# EAGLE design CMUFull (EAGLE 8.6.0)
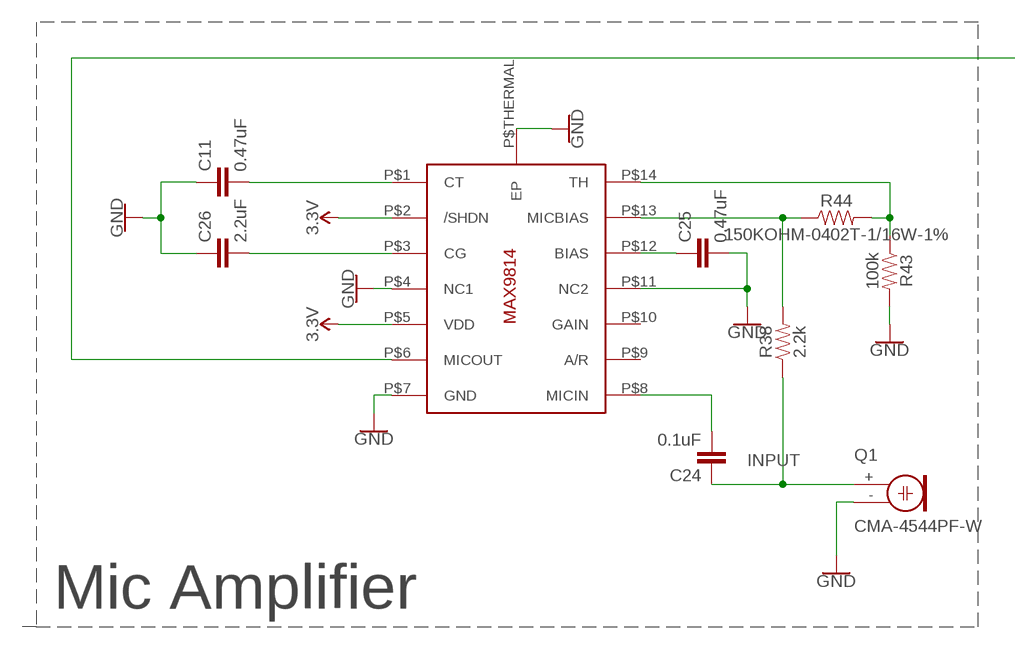
[diagram p0: schematic, sheet 1, part 1 of 2]
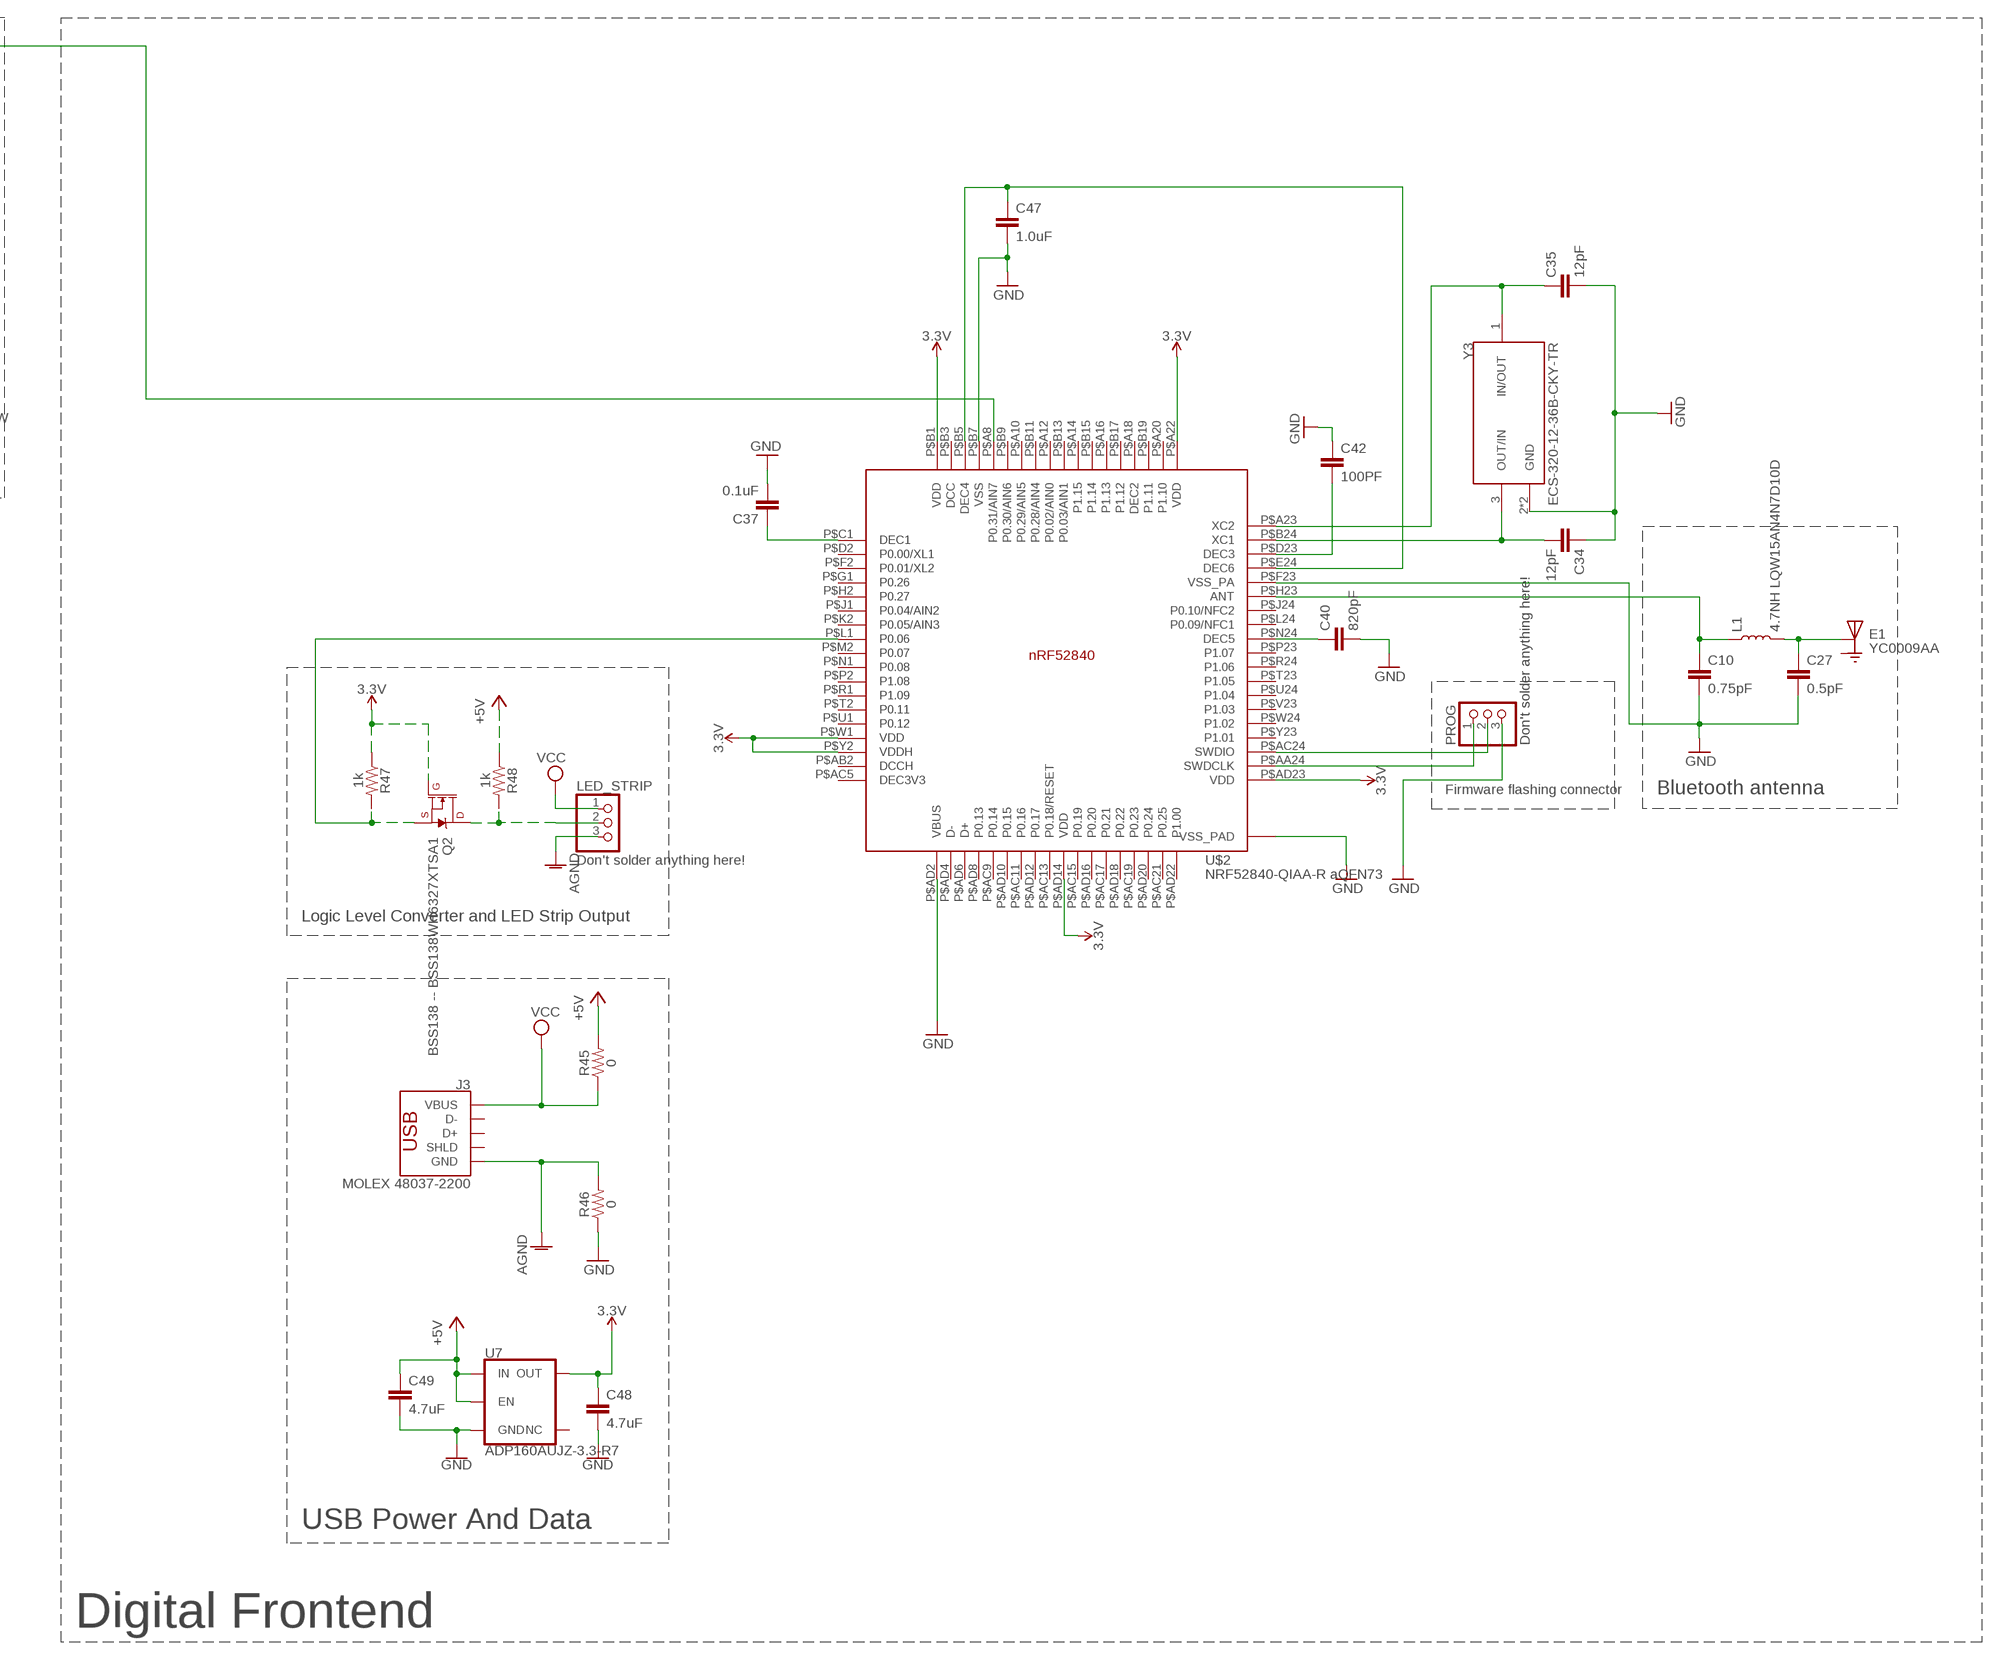
[diagram p1: schematic, sheet 1, part 2 of 2]

## Parts
C10  0.75pF  CAP-0402-TIGHT  [0402-TIGHT]
C11  0.47uF  CAP-0402-TIGHT  [0402-TIGHT]
C24  0.1uF  0.1UF-0402-6.3V-10%-X7R  [0402]
C25  0.47uF  CAP-0402-TIGHT  [0402-TIGHT]
C26  2.2uF  2.2UF-0402_TIGHT-10V-10%-X5R  [0402-TIGHT]
C27  0.5pF  0.5PF-0402_TIGHT-50V-PM0.05PF-NP0  [0402-TIGHT]
C34  12pF  12PF-0402T-50V-5%  [0402-TIGHT]
C35  12pF  12PF-0402T-50V-5%  [0402-TIGHT]
C37  0.1uF  0.1UF-0402-16V-10%  [0402]
C40  820pF  CAP-0402  [0402]
C42  100PF  100PF-0402-50V-5%  [0402]
C47  1.0uF  1.0UF-0402-16V-10%  [0402]
C48  4.7uF  4.7UF-0402_TIGHT-6.3V-20%-X5R  [0402-TIGHT]
C49  4.7uF  4.7UF-0402_TIGHT-6.3V-20%-X5R  [0402-TIGHT]
E1  YC0009AA  [XCVR_YC0009AA]
J3  MOLEX 48037-2200  USB_A_SMT_MALE  [USB-A-SMT-MALE]
L1  4.7NH LQW15AN4N7D10D  INDUCTOR-0402-3.9NH  [0402]
LED_STRIP  Don't solder anything here!  PINHD-1X3  [1X03]
PROG  Don't solder anything here!  PINHD-1X3  [1X03]
Q1  CMA-4544PF-W  ELECTRET  [9.7ELECTRET]
Q2  BSS138 -- BSS138WH6327XTSA1  MOSFET-NCH-BSS138  [SOT23-3]
R38  2.2k  2.2KOHM-0402T-1/16W-1%  [0402-TIGHT]
R43  100k  100KOHM-0402T-1/16W-1%  [0402-TIGHT]
R44  150KOHM-0402T-1/16W-1%  [0402-TIGHT]
R45  0  0OHM-0402-1/10W  [0402]
R46  0  0OHM-0402-1/10W  [0402]
R47  1k  1KOHM-0402T-1/16W-1%  [0402-TIGHT]
R48  1k  1KOHM-0402T-1/16W-1%  [0402-TIGHT]
U7  ADP160AUJZ-3.3-R7  ADP160  [SOT23-5]
U$1  MAX9814ETD+T  MAX9814TDFN14  [TDFN14_3X3MM]
U$2  NRF52840-QIAA-R aQFN73  NRF52840_QF  [AQFN50P700X700X85_HS-74N]
Y3  ECS-320-12-36B-CKY-TR  [XTAL_ECS-163.84-10-36-JGN-TR]

## Nets
3.3V: C48.1 Q2.1(G) R47.1 U7.5(OUT) U$1.P$2(/SHDN) U$1.P$5(VDD) U$2.P$A22(VDD) U$2.P$AD14(VDD) U$2.P$AD23(VDD) U$2.P$B1(VDD) U$2.P$W1(VDD) U$2.P$Y2(VDDH)
+5V: C49.1 R45.2 R48.1 U7.1(IN) U7.3(EN)
AGND [5VSupply]: J3.GND1(GND) LED_STRIP.3 R46.2
GND: C10.2 C11.1 C25.2 C26.1 C27.2 C34.1 C35.2 C37.2 C40.2 C42.1 C47.2 C48.2 C49.2 PROG.3 Q1.- R43.2 R46.1 U7.2(GND) U$1.P$4(NC1) U$1.P$7(GND) U$1.P$11(NC2) U$1.P$THERMAL(EP) U$2.P$74(VSS_PAD) U$2.P$AD2(VBUS) U$2.P$B7(VSS) U$2.P$F23(VSS_PA) Y3.2(GND) Y3.4(GND)
INPUT: C24.1 Q1.+ R38.1
N$3: U$1.P$6(MICOUT) U$2.P$A8(P0.31/AIN7)
N$35: C25.1 U$1.P$12(BIAS)
N$41: C24.2 U$1.P$8(MICIN)
N$42: C11.2 U$1.P$1(CT)
N$43: C26.2 U$1.P$3(CG)
N$44: R43.1 R44.2 U$1.P$14(TH)
N$45: R38.2 R44.1 U$1.P$13(MICBIAS)
N$48: C35.1 U$2.P$A23(XC2) Y3.1(IN/OUT)
N$49: C34.2 U$2.P$B24(XC1) Y3.3(OUT/IN)
N$51: C37.1 U$2.P$C1(DEC1)
N$54: PROG.1 U$2.P$AA24(SWDCLK)
N$56: PROG.2 U$2.P$AC24(SWDIO)
N$59: LED_STRIP.2 Q2.3(D) R48.2
N$60: C47.1 U$2.P$B5(DEC4) U$2.P$E24(DEC6)
N$62: C40.1 U$2.P$N24(DEC5)
N$63: C42.2 U$2.P$D23(DEC3)
N$64: C10.1 L1.1 U$2.P$H23(ANT)
N$65: C27.1 E1.1(INPUT) L1.2
N$73: Q2.2(S) R47.2 U$2.P$L1(P0.06)
VCC [5VSupply]: J3.VBUS1(VBUS) LED_STRIP.1 R45.1
Unconnected: J3.D+1(D+) J3.D-1(D-) J3.SHLD1(SHLD) J3.SHLD2(SHLD) U7.4(NC) U$1.P$9(A/R) U$1.P$10(GAIN) U$2.P$A10(P0.29/AIN5) U$2.P$A12(P0.02/AIN0) U$2.P$A14(P1.15) U$2.P$A16(P1.13) U$2.P$A18(DEC2) U$2.P$A20(P1.10) U$2.P$AB2(DCCH) U$2.P$AC5(DEC3V3) U$2.P$AC9(P0.14) U$2.P$AC11(P0.16) U$2.P$AC13(P0.18/RESET) U$2.P$AC15(P0.19) U$2.P$AC17(P0.21) U$2.P$AC19(P0.23) U$2.P$AC21(P0.25) U$2.P$AD4(D-) U$2.P$AD6(D+) U$2.P$AD8(P0.13) U$2.P$AD10(P0.15) U$2.P$AD12(P0.17) U$2.P$AD16(P0.20) U$2.P$AD18(P0.22) U$2.P$AD20(P0.24) U$2.P$AD22(P1.00) U$2.P$B3(DCC) U$2.P$B9(P0.30/AIN6) U$2.P$B11(P0.28/AIN4) U$2.P$B13(P0.03/AIN1) U$2.P$B15(P1.14) U$2.P$B17(P1.12) U$2.P$B19(P1.11) U$2.P$D2(P0.00/XL1) U$2.P$F2(P0.01/XL2) U$2.P$G1(P0.26) U$2.P$H2(P0.27) U$2.P$J1(P0.04/AIN2) U$2.P$J24(P0.10/NFC2) U$2.P$K2(P0.05/AIN3) U$2.P$L24(P0.09/NFC1) U$2.P$M2(P0.07) U$2.P$N1(P0.08) U$2.P$P2(P1.08) U$2.P$P23(P1.07) U$2.P$R1(P1.09) U$2.P$R24(P1.06) U$2.P$T2(P0.11) U$2.P$T23(P1.05) U$2.P$U1(P0.12) U$2.P$U24(P1.04) U$2.P$V23(P1.03) U$2.P$W24(P1.02) U$2.P$Y23(P1.01)

## Notes on the sheet
- Mic Amplifier
- Firmware flashing connector | Bluetooth antenna
- Logic Level Converter and LED Strip Output
- USB Power And Data
- Digital Frontend

## Power pins joined to a net without a drawn wire
GND: E1.2(GND) E1.3(GND)

## Library data of the parts
C10 C11 C25 C40 = SparkFun-Capacitors:CAP
C24 = SparkFun-Capacitors:0.1UF: 0.1µF ceramic capacitors A capacitor is a passive two-terminal electrical component used to store electrical energy temporarily in an electric field.; PROD_ID: CAP-14993
C26 = SparkFun-Capacitors:2.2UF: 2.2µF ceramic capacitors A capacitor is a passive two-terminal electrical component used to store electrical energy temporarily in an electric field.; PROD_ID: CAP-14232
C27 = SparkFun-Capacitors:0.5PF: 0.5pF ceramic capacitors A capacitor is a passive two-terminal electrical component used to store electrical energy temporarily in an electric field.; PROD_ID: CAP-14362
C34 C35 = SparkFun-Capacitors:12PF: 12pF ceramic capacitors A capacitor is a passive two-terminal electrical component used to store electrical energy temporarily in an electric field.; PROD_ID: CAP-14665
C37 = SparkFun-Capacitors:0.1UF: 0.1µF ceramic capacitors A capacitor is a passive two-terminal electrical component used to store electrical energy temporarily in an electric field.; PROD_ID: CAP-12416
C42 = SparkFun-Capacitors:100PF: 100pF/0.1nF ceramic capacitors A capacitor is a passive two-terminal electrical component used to store electrical energy temporarily in an electric field.; PROD_ID: CAP-13458
C47 = SparkFun-Capacitors:1.0UF: 1µF ceramic capacitors A capacitor is a passive two-terminal electrical component used to store electrical energy temporarily in an electric field.; PROD_ID: CAP-12417
C48 C49 = SparkFun-Capacitors:4.7UF: 4.7µF ceramic capacitors A capacitor is a passive two-terminal electrical component used to store electrical energy temporarily in an electric field.; PROD_ID: CAP-14240
E1 = YC0009AA:YC0009AA: 2400-2500 MHz Wi-Fi（BT）, 3.2*1.6*0.5mm,ceramic SMD Antenna Check prices <https://pricing.snapeda.com/parts/YC0009AA/Quectel/view-part?ref=eda>; AVAILABILITY: In Stock; DESCRIPTION: 2400-2500 MHz Wi-Fi（BT）, 3.2*1.6*0.5mm,ceramic SMD Antenna; MF: Quectel; MP: YC0009AA; PACKAGE: None; PRICE: None; PURCHASE-URL: https://pricing.snapeda.com/search/part/YC0009AA/?ref=eda
J3 = SparkFun-Connectors:USB_A: USB-A Connector Male and female variants, as well as PTH and SMT variants SparkFun Products: SparkFun XBee Explorer Dongle <https://www.sparkfun.com/products/11697> PTH Male SparkFun MicroView-USB Programmer <https://www.sparkfun.com/products/12924> SMT Male SparkFun USB Type A Female Breakout <https://www.sparkfun.com/products/12700> SMT Female; PROD_ID: CONN-11499
L1 = SparkFun-Coils:INDUCTOR: Inductors Resist changes in electrical current. Basically a coil of wire. SparkFun Products: SparkFun Load Cell Amplifier - HX711 <https://www.sparkfun.com/products/13879> IOIO-OTG - V2.2 <https://www.sparkfun.com/products/13613>; PROD_ID: NDUC-13457; VALUE: 3.9NH
LED_STRIP PROG = pinhead:PINHD-1X3: PIN HEADER
Q1 = adafruit:ELECTRET: Electret microphone Thru hole 2.54mm spacing with 9.7mm diameter
Q2 = SparkFun-DiscreteSemi:MOSFET-NCH: N-channel MOSFETs Voltage controlled devices that allow control of high current outputs. SparkFun Products: SparkFun OpenScale <https://www.sparkfun.com/products/13261> SparkFun Digital Sandbox <https://www.sparkfun.com/products/12651> SparkFun Monster Moto Shield <https://www.sparkfun.com/products/10182> SparkFun MOSFET Power Controller <https://www.sparkfun.com/products/11214>; PROD_ID: TRANS-00830; VALUE: 220mA/50V/3.5Ω
R38 = SparkFun-Resistors:2.2KOHM: 2.2kΩ resistor A resistor is a passive two-terminal electrical component that implements electrical resistance as a circuit element. Resistors act to reduce current flow, and, at the same time, act to lower voltage levels within circuits. - Wikipedia; PROD_ID: RES-14341
R43 = SparkFun-Resistors:100KOHM: 100kΩ resistor A resistor is a passive two-terminal electrical component that implements electrical resistance as a circuit element. Resistors act to reduce current flow, and, at the same time, act to lower voltage levels within circuits. - Wikipedia; PROD_ID: RES-13495
R44 = SparkFun-Resistors:150KOHM: 150kΩ resistor A resistor is a passive two-terminal electrical component that implements electrical resistance as a circuit element. Resistors act to reduce current flow, and, at the same time, act to lower voltage levels within circuits. - Wikipedia; PROD_ID: RES-15093
R45 R46 = SparkFun-Resistors:0OHM: 0Ω resistor A resistor is a passive two-terminal electrical component that implements electrical resistance as a circuit element. Resistors act to reduce current flow, and, at the same time, act to lower voltage levels within circuits. - Wikipedia; PROD_ID: RES-14244
R47 R48 = SparkFun-Resistors:1KOHM: 1kΩ resistor A resistor is a passive two-terminal electrical component that implements electrical resistance as a circuit element. Resistors act to reduce current flow, and, at the same time, act to lower voltage levels within circuits. - Wikipedia; PROD_ID: RES-14342
U7 = SparkFun-IC-Power:ADP160: Nanopower LDO Iq less than 1uA for low Iload; PROD_ID: VREG-11306; VALUE: ADP160
U$1 = adafruit:MAX9814
U$2 = Nordic_nRF:NRF52840_QF: nRF52840 Features Advanced Single chip 2.4 GHz multi-protocol SoC 32-bit ARM Cortex-M4F Processor 1.7v to 5.5v operation 1MB flash + 256kB RAM Bluetooth 5 support for long range and high throughput 802.15.4 radio support On-chip NFC PPI –Programmable Peripheral Interconnect Automated power management system with automatic power management of each peripheral Configurable I/O mapping for analog and digital I/O 48 x GPIO 1 x QSPI 4 x Master/Slave SPI 2 x Two-wire interface (I²C) I²S interface 2 x UART 4 x PWM USB 2.0 controller ARM TrustZone CryptoCell-310 Cryptographic and security module AES 128-bit ECB/CCM/AAR hardware accelerator Digital microphone interface (PDM) Quadrature decoder 12-bit ADC Low power comparator On-chip 50Ω balun On-air compatible with nRF52, nRF51 and nRF24 Series Applications Advanced high performance wearables Wearables for secure payments Virtual Reality/Augmented Reality systems Smart Home sensor networks Smart city sensor networks High performance HID controllers Internet of Things (IoT) sensor networks Smart door locks Smart lighting networks Connected white goods
Y3 = ECS-320-12-36B-CKY-TR:ECS-320-12-36B-CKY-TR: The minature ECX-2236 is a compact SMD Crystal. The industry standard 2.5 x 2.0 x 0.55 mm ceramic package is ideal for today’s SMD manufacturing environment. Check prices <https://pricing.snapeda.com/parts/ECS-320-12-36B-CKY-TR/ECS/view-part?ref=eda>; AVAILABILITY: In Stock; DESCRIPTION: 32MHz ±10ppm Crystal 12pF 40 Ohms 4-SMD, No Lead; MF: ECS; MP: ECS-320-12-36B-CKY-TR; PACKAGE: SMD-4 ECS International; PRICE: None; PURCHASE-URL: https://pricing.snapeda.com/search/part/ECS-320-12-36B-CKY-TR/?ref=eda

## Net classes
0 default: width 0.152 mm, clearance 0.152 mm
1 5VSupply: width 0.914 mm, clearance 0.254 mm

## Board
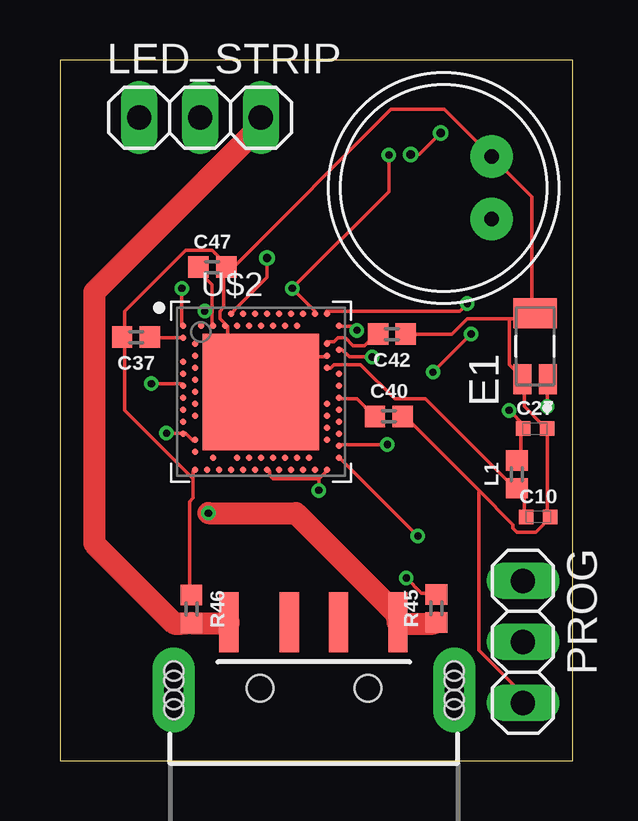
[diagram p2: board, top side]
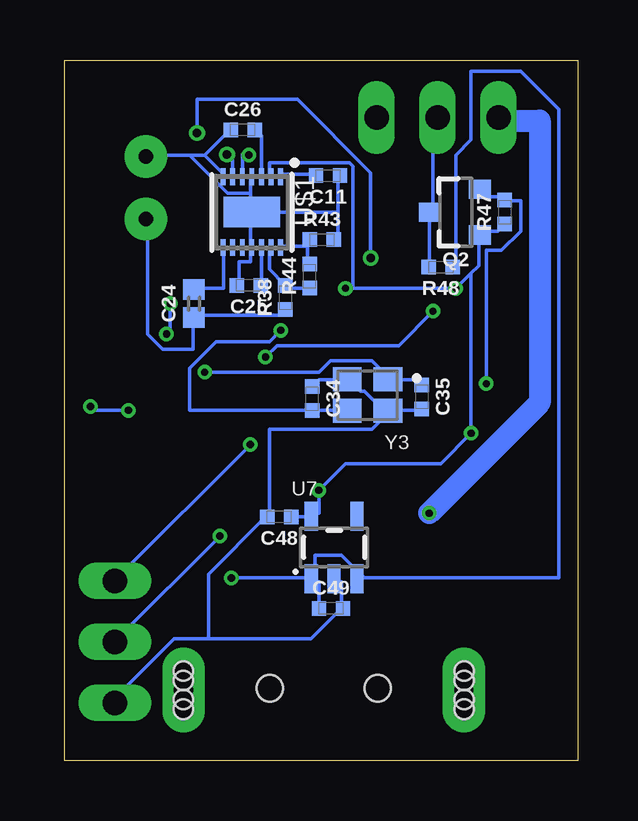
[diagram p3: board, bottom side, seen from below]

Size 21.39 x 29.2 mm. Coordinates in mm from the lower left corner, seen from the top.
Outline: 0,0 21.39,0 21.39,29.2 0,29.2 0,0
Copper layers (1*16): Top 0.035mm / dielectric 1mm / Bottom 0.035mm
Design rules "default *": minimum track width 6mil, minimum drill 0.3mm, track to track 6mil, track to pad 6mil, pad to pad 6mil, via to via 6mil, smd to smd 6mil, copper to edge 10mil, drill to drill 6mil, minimum pad ring 10mil, minimum via ring 6mil, stop-mask expansion 4mil, vias tented up to drill 0mil, thermal gap 10mil

### Footprints (pad centres in the part's own frame; a part is rotated, then mirrored left to right if it is on the bottom)
0402-TIGHT = smd 0.6 x 0.6: 1 -0.5,0; 2 0.5,0
0402 = smd 0.85 x 0.9: 1 -0.58,0; 2 0.58,0
XCVR_YC0009AA = smd 1.25 x 0.74: 1 -1.375,-0.53; 3 -1.375,0.53 | smd 1.25 x 1.8: 2 1.375,0
USB-A-SMT-MALE = smd 2.5 x 0.8: D+1 10.95,1.027; D-1 10.95,-1.027; GND1 10.95,3.551; VBUS1 10.95,-3.5 | drill 0.8 pad 1.778 long: SHLD1 8.13,-5.85; SHLD2 8.13,5.85 | hole 1.1: 8.2,2.25; 8.2,-2.25 | hole 0.8: 8.53,-5.85; 8.93,-5.85; 7.73,-5.85; 7.33,-5.85; 8.53,5.85; 8.93,5.85; 7.73,5.85; 7.33,5.85
1X03 = drill 1.016 long: 1 -2.54,0; 2 0,0; 3 2.54,0
9.7ELECTRET = drill 0.6 pad 1.778: + 1.3,2; - -1.3,2
SOT23-3 = smd 0.8 x 0.9: 1 -0.95,-1; 2 0.95,-1; 3 0,1.1
SOT23-5 = smd 0.55 x 1.2: 1 -0.95,-1.3; 2 0,-1.3; 3 0.95,-1.3; 4 0.95,1.3; 5 -0.95,1.3
TDFN14_3X3MM = smd 0.7 x 0.2: P$1 -1.475,1.2; P$2 -1.475,0.8; P$3 -1.475,0.4; P$4 -1.475,0; P$5 -1.475,-0.4; P$6 -1.475,-0.8; P$7 -1.475,-1.2; P$8 1.475,-1.2; P$9 1.475,-0.8; P$10 1.475,-0.4; P$11 1.475,0; P$12 1.475,0.4; P$13 1.475,0.8; P$14 1.475,1.2 | smd 1.27 x 2.35: P$THERMAL 0,0
AQFN50P700X700X85_HS-74N = smd 4.85 x 4.85: P$74 0,0 | smd 0.275 x 0.275: P$A8 -1.25,3.25; P$A10 -0.75,3.25; P$A12 -0.25,3.25; P$A14 0.25,3.25; P$A16 0.75,3.25; P$A18 1.25,3.25; P$A20 1.75,3.25; P$A22 2.25,3.25; P$A23 2.75,3.25; P$AA24 3.25,-2.25; P$AB2 -2.75,-2.5; P$AC5 -2,-2.75; P$AC9 -1,-2.75; P$AC11 -0.5,-2.75; P$AC13 0,-2.75; P$AC15 0.5,-2.75; P$AC17 1,-2.75; P$AC19 1.5,-2.75; P$AC21 2,-2.75; P$AC24 3.25,-2.75; P$AD2 -2.75,-3.25; P$AD4 -2.25,-3.25; P$AD6 -1.75,-3.25; P$AD8 -1.25,-3.25; P$AD10 -0.75,-3.25; P$AD12 -0.25,-3.25; P$AD14 0.25,-3.25; P$AD16 0.75,-3.25; P$AD18 1.25,-3.25; P$AD20 1.75,-3.25; P$AD22 2.25,-3.25; P$AD23 2.75,-3.25; P$B1 -3.25,2.75; P$B3 -2.5,2.75; P$B5 -2,2.75; P$B7 -1.5,2.75; P$B9 -1,2.75; P$B11 -0.5,2.75; P$B13 0,2.75; P$B15 0.5,2.75; P$B17 1,2.75; P$B19 1.5,2.75; P$B24 3.25,2.75; P$C1 -3.25,2.25; P$D2 -2.75,2; P$D23 2.75,2; P$E24 3.25,1.75; P$F2 -2.75,1.5; P$F23 2.75,1.5; P$G1 -3.25,1.25; P$H2 -2.75,1; P$H23 2.75,1; P$J1 -3.25,0.75; P$J24 3.25,0.75; P$K2 -2.75,0.5; P$L1 -3.25,0.25; P$L24 3.25,0.25; P$M2 -2.75,0; P$N1 -3.25,-0.25; P$N24 3.25,-0.25; P$P2 -2.75,-0.5; P$P23 2.75,-0.5; P$R1 -3.25,-0.75; P$R24 3.25,-0.75; P$T2 -2.75,-1; P$T23 2.75,-1; P$U1 -3.25,-1.25; P$U24 3.25,-1.25; P$V23 2.75,-1.5; P$W1 -3.25,-1.75; P$W24 3.25,-1.75; P$Y2 -2.75,-2; P$Y23 2.75,-2
XTAL_ECS-163.84-10-36-JGN-TR = smd 1.2 x 1: 1 -0.85,-0.65; 2 0.85,-0.65; 3 0.85,0.65; 4 -0.85,0.65

### Placement (x,y rotation side)
C10  19.94,10.16 0 top
C11  10.41,24.38 180 bottom
C24  16,19.05 90 bottom
C25  13.72,19.81 180 bottom
C26  13.97,26.29 0 bottom
C27  19.81,13.84 0 top
C34  11.07,15.09 270 bottom
C35  6.5,15.16 270 bottom
C37  3.18,17.65 180 top
C40  13.72,14.35 0 top
C42  13.84,17.78 180 top
C47  6.35,20.57 0 top
C48  12.45,10.16 180 bottom
C49  10.29,6.35 0 bottom
E1  19.81,17.27 90 top
J3  10.59,-5.18 90 top
L1  19.05,11.94 90 top
LED_STRIP  5.84,26.8 0 top
PROG  19.3,4.95 270 top
Q1  16,23.88 270 top
Q2  5.08,22.86 90 bottom
R38  12.19,19.3 90 bottom
R43  10.67,21.72 0 bottom
R44  11.18,20.19 90 bottom
R45  15.7,6.35 90 top
R46  5.49,6.32 270 top
R47  3.05,22.86 90 bottom
R48  5.71,20.57 180 bottom
U7  10.16,8.89 0 bottom
U$1  13.59,22.86 270 bottom
U$2  8.38,15.37 0 top
Y3  8.76,15.24 180 bottom

### Tracks (layer width: path | path; a pad name or v marks a point on that pad's centre or on a via)
3.3V  (via drill 0.3)
  Top 0.152: 10.79,11.75 8.89,11.75 8.73,11.91 8.73,12.06 U$2.P$AD14 | 10.79,11.75 11.11,12.06 U$2.P$AD23 | v10.79,11.27 10.79,11.75 | U$2.P$Y2 5.56,13.34 5.24,13.65 U$2.P$W1 5.08,13.65 v4.45,13.65 | v5.08,19.68 5.08,18.1 U$2.P$B1 | U$2.P$A22 10.64,18.73 v9.68,19.68 13.72,23.72 v13.72,25.24
  Bottom 0.152: C48.1 11.11,10.16 U7.5 10.95,10.32 10.79,10.32 v10.79,11.27 9.68,12.38 5.71,12.38 v4.45,13.65 4.45,20.32 | 4.45,20.32 4.13,20.64 4.13,21.91 Q2.1 3.97,22.07 3.33,22.07 3.18,22.22 R47.1 | 4.45,20.32 v5.08,19.68 9.37,19.68 | 9.37,19.68 v9.68,19.68 | 9.37,19.68 9.37,24.77 9.53,24.92 12.86,24.92 12.86,24.45 U$1.P$2 | v13.72,25.24 13.75,25.27 13.97,25.27 13.97,24.45 U$1.P$5
+5V  (via drill 0.3)
  Top 0.152: v14.45,7.62 15.08,6.98 15.56,6.98 R45.2
  Bottom 0.152: C49.1 10.79,7.46 10.95,7.46 U7.1 | v14.45,7.62 11.11,7.62 U7.1 | 8.89,7.62 9.21,7.62 U7.3 | 8.89,7.62 0.79,7.62 0.79,27.15 2.38,28.73 4.45,28.73 4.45,25.88 5.08,25.24 5.08,20.64 R48.1 | 8.89,7.62 9.84,8.57 10.95,8.57 10.95,7.62 U7.1
AGND
  Top 0.914: J3.GND1 6.99,5.71 5.56,5.71 R46.2 5.08,5.71 4.76,5.71 1.43,9.05 1.43,19.53 8.26,26.35 8.26,26.67 LED_STRIP.3
GND
  Top 0.152: 5.56,11.75 5.56,10.95 5.4,10.79 5.4,6.98 R46.1 | 5.56,11.75 5.56,12.06 U$2.P$AD2 | 5.56,11.75 2.7,14.61 2.7,17.62 C37.2 2.7,17.78 2.7,18.73 5.24,21.27 6.35,21.27 6.99,20.64 | 6.99,16.83 6.99,16.67 8.26,15.4 U$2.P$74 6.99,16.83 | 6.99,16.83 6.99,18.1 | 6.99,16.83 11.11,16.83 U$2.P$F23 | 6.99,18.1 6.67,18.41 6.67,18.73 6.83,18.89 6.83,20.48 C47.2 6.99,20.64 | 6.99,18.1 U$2.P$B7 | C42.1 16.35,17.78 16.99,18.41 18.73,18.41 | 18.73,18.41 19.53,18.41 19.68,18.57 E1.2 19.68,18.73 19.68,23.49 18.1,25.08 Q1.- 17.94,25.24 16.03,27.15 13.81,27.15 7.3,20.64 6.99,20.64 | 17.46,11.27 18.89,9.84 18.89,9.68 19.05,9.52 19.84,9.52 20.48,10.16 C10.2 20.32,10.16 20.32,13.81 C27.2 20.16,13.97 19.37,14.76 19.37,15.88 E1.3 19.21,16.03 18.73,16.51 18.73,18.41 | 17.46,11.27 14.45,14.29 C40.2 | 17.46,11.27 17.46,4.6 19.21,2.86 19.21,2.54 PROG.3
  Bottom 0.152: C34.1 10.95,15.72 10.79,15.88 9.68,15.88 Y3.2 9.53,15.88 9.05,15.4 8.89,15.4 8.1,14.61 7.94,14.61 Y3.4 | Y3.4 7.94,14.45 8.57,13.81 12.86,13.81 12.86,10.16 C48.2 13.02,10.16 15.4,7.78 15.4,5.08 | C35.2 6.51,14.61 7.78,14.61 Y3.4 | 9.84,6.35 9.84,7.46 10.16,7.46 U7.2 | 9.84,6.35 11.11,5.08 15.4,5.08 | 15.4,5.08 16.83,5.08 19.37,2.54 PROG.3 | 9.84,6.35 C49.2 | 10,22.86 10,21.75 10.16,21.75 R43.2 | 10,22.86 10,24.29 C11.1 | C25.2 14.13,19.84 14.13,20.8 13.65,20.8 13.65,21.27 U$1.P$11 13.65,21.43 13.65,22.86 | 13.65,22.86 13.65,23.65 | 13.65,23.65 13.65,24.29 U$1.P$4 | 13.65,22.86 U$1.P$THERMAL 10,22.86 | 15.56,25.24 14.61,26.19 C26.1 | 16.19,25.24 17.94,25.24 Q1.- | 16.19,25.24 15.56,25.24 | 15.56,25.24 14.76,24.45 U$1.P$7 | 13.65,23.65 14.61,23.65 16.19,25.24
INPUT
  Bottom 0.152: R38.1 12.22,18.73 12.38,18.57 15.88,18.57 C24.1 16.03,18.41 16.03,17.14 17.3,17.14 17.94,17.78 17.94,22.54 Q1.+
N$3  (via drill 0.35)
  Top 0.152: U$2.P$A8 7.27,18.75 7.27,18.77 8.64,20.14 v8.64,20.95 | v15.88,26.16 14.99,25.27 14.74,25.27 | 14.73,25.27 14.74,25.27 | 14.74,25.27 v14.62,25.26
  Bottom 0.152: v8.64,20.95 8.64,24.51 11.68,27.56 15.88,27.56 v15.88,26.16 | v14.62,25.26 14.39,25.02 U$1.P$6
N$35
  Bottom 0.152: C25.1 13.18,19.84 13.18,21.27 U$1.P$12
N$41
  Bottom 0.152: U$1.P$8 14.76,21.27 14.76,19.68 15.88,19.68 C24.2
N$42
  Bottom 0.152: C11.2 10.95,24.45 12.38,24.45 U$1.P$1
N$43
  Bottom 0.152: C26.2 13.34,26.19 13.18,26.03 13.18,24.45 U$1.P$3
N$44
  Bottom 0.152: 11.27,21.43 11.27,21.59 R43.1 11.27,21.43 | 11.27,21.43 11.27,20.8 R44.2 | 11.27,21.43 12.38,21.43 U$1.P$14
N$45
  Bottom 0.152: R44.1 11.27,19.68 12.07,19.68 R38.2 12.22,19.84 12.86,20.48 12.86,21.27 U$1.P$13
N$48  (via drill 0.3)
  Top 0.152: v16.99,19.05 16.67,18.73 11.11,18.73 U$2.P$A23 | v15.56,16.19 v17.14,17.78
  Bottom 0.152: v16.99,19.05 16.99,17.78 v17.14,17.78 | v15.56,16.19 10.79,16.19 10.32,16.67 8.57,16.67 7.94,16.03 Y3.1 7.78,15.88 6.67,15.88 6.51,15.72 C35.1
N$49  (via drill 0.3)
  Top 0.152: v12.38,17.94 12.22,18.1 11.75,18.1 U$2.P$B24
  Bottom 0.152: v12.38,17.94 12.86,17.46 15.08,17.46 16.19,16.35 16.19,14.61 11.11,14.61 C34.2 10.95,14.61 9.68,14.61 Y3.3
N$51
  Top 0.152: U$2.P$C1 5.08,17.62 3.81,17.62 C37.1
N$54  (via drill 0.3)
  Top 0.152: v13.65,13.18 11.75,13.18 U$2.P$AA24
  Bottom 0.152: v13.65,13.18 19.21,7.62 PROG.1
N$56  (via drill 0.3)
  Top 0.152: v14.92,9.37 11.75,12.54 U$2.P$AC24
  Bottom 0.152: v14.92,9.37 19.21,5.08 PROG.2
N$59
  Bottom 0.152: R48.2 6.19,20.64 6.19,22.86 Q2.3 6.03,22.86 6.03,26.67 5.87,26.67 LED_STRIP.2
N$60  (via drill 0.3)
  Top 0.152: 6.35,18.73 6.35,19.84 5.71,20.48 C47.1 | 6.35,18.73 6.35,18.1 U$2.P$B5 | v13.02,16.83 12.07,16.83 11.75,17.14 U$2.P$E24 | 6.35,18.73 v6.03,18.73
  Bottom 0.152: v13.02,16.83 12.54,17.3 7.46,17.3 v6.03,18.73
N$62
  Top 0.152: U$2.P$N24 11.75,15.08 12.38,15.08 13.02,14.45 C40.1
N$63
  Top 0.152: U$2.P$D23 11.11,17.46 11.43,17.46 11.59,17.62 11.91,17.62 12.22,17.3 12.7,17.3 13.18,17.78 C42.2
N$64
  Top 0.152: 19.05,11.27 15.24,15.08 13.97,15.08 12.54,16.51 11.43,16.51 11.27,16.35 11.11,16.35 U$2.P$H23 | 19.05,11.27 19.37,10.95 19.37,10.16 C10.1 | 19.05,11.27 L1.1
N$65  (via drill 0.3)
  Top 0.152: L1.2 19.05,12.54 19.21,12.7 19.21,13.81 C27.1 19.37,13.97 v18.73,14.61 | v20.32,14.76 20.32,15.88 E1.1
  Bottom 0.152: v20.32,14.76 20.16,14.61 v18.73,14.61
N$73  (via drill 0.3)
  Top 0.152: v3.81,15.72 5.08,15.72 U$2.P$L1
  Bottom 0.152: v3.81,15.72 3.81,21.27 3.18,21.27 2.38,22.07 2.38,23.34 3.02,23.34 R47.2 3.18,23.49 3.81,23.49 3.97,23.65 Q2.2
VCC  (via drill 0.3)
  Top 0.914: R45.1 15.56,5.71 14.13,5.71 J3.VBUS1 13.97,6.19 9.84,10.32 v6.19,10.32
  Bottom 0.914: v6.19,10.32 1.59,14.92 1.59,26.67 3.18,26.67 LED_STRIP.1